# EAGLE design CAN-Adapter (EAGLE 6.2)
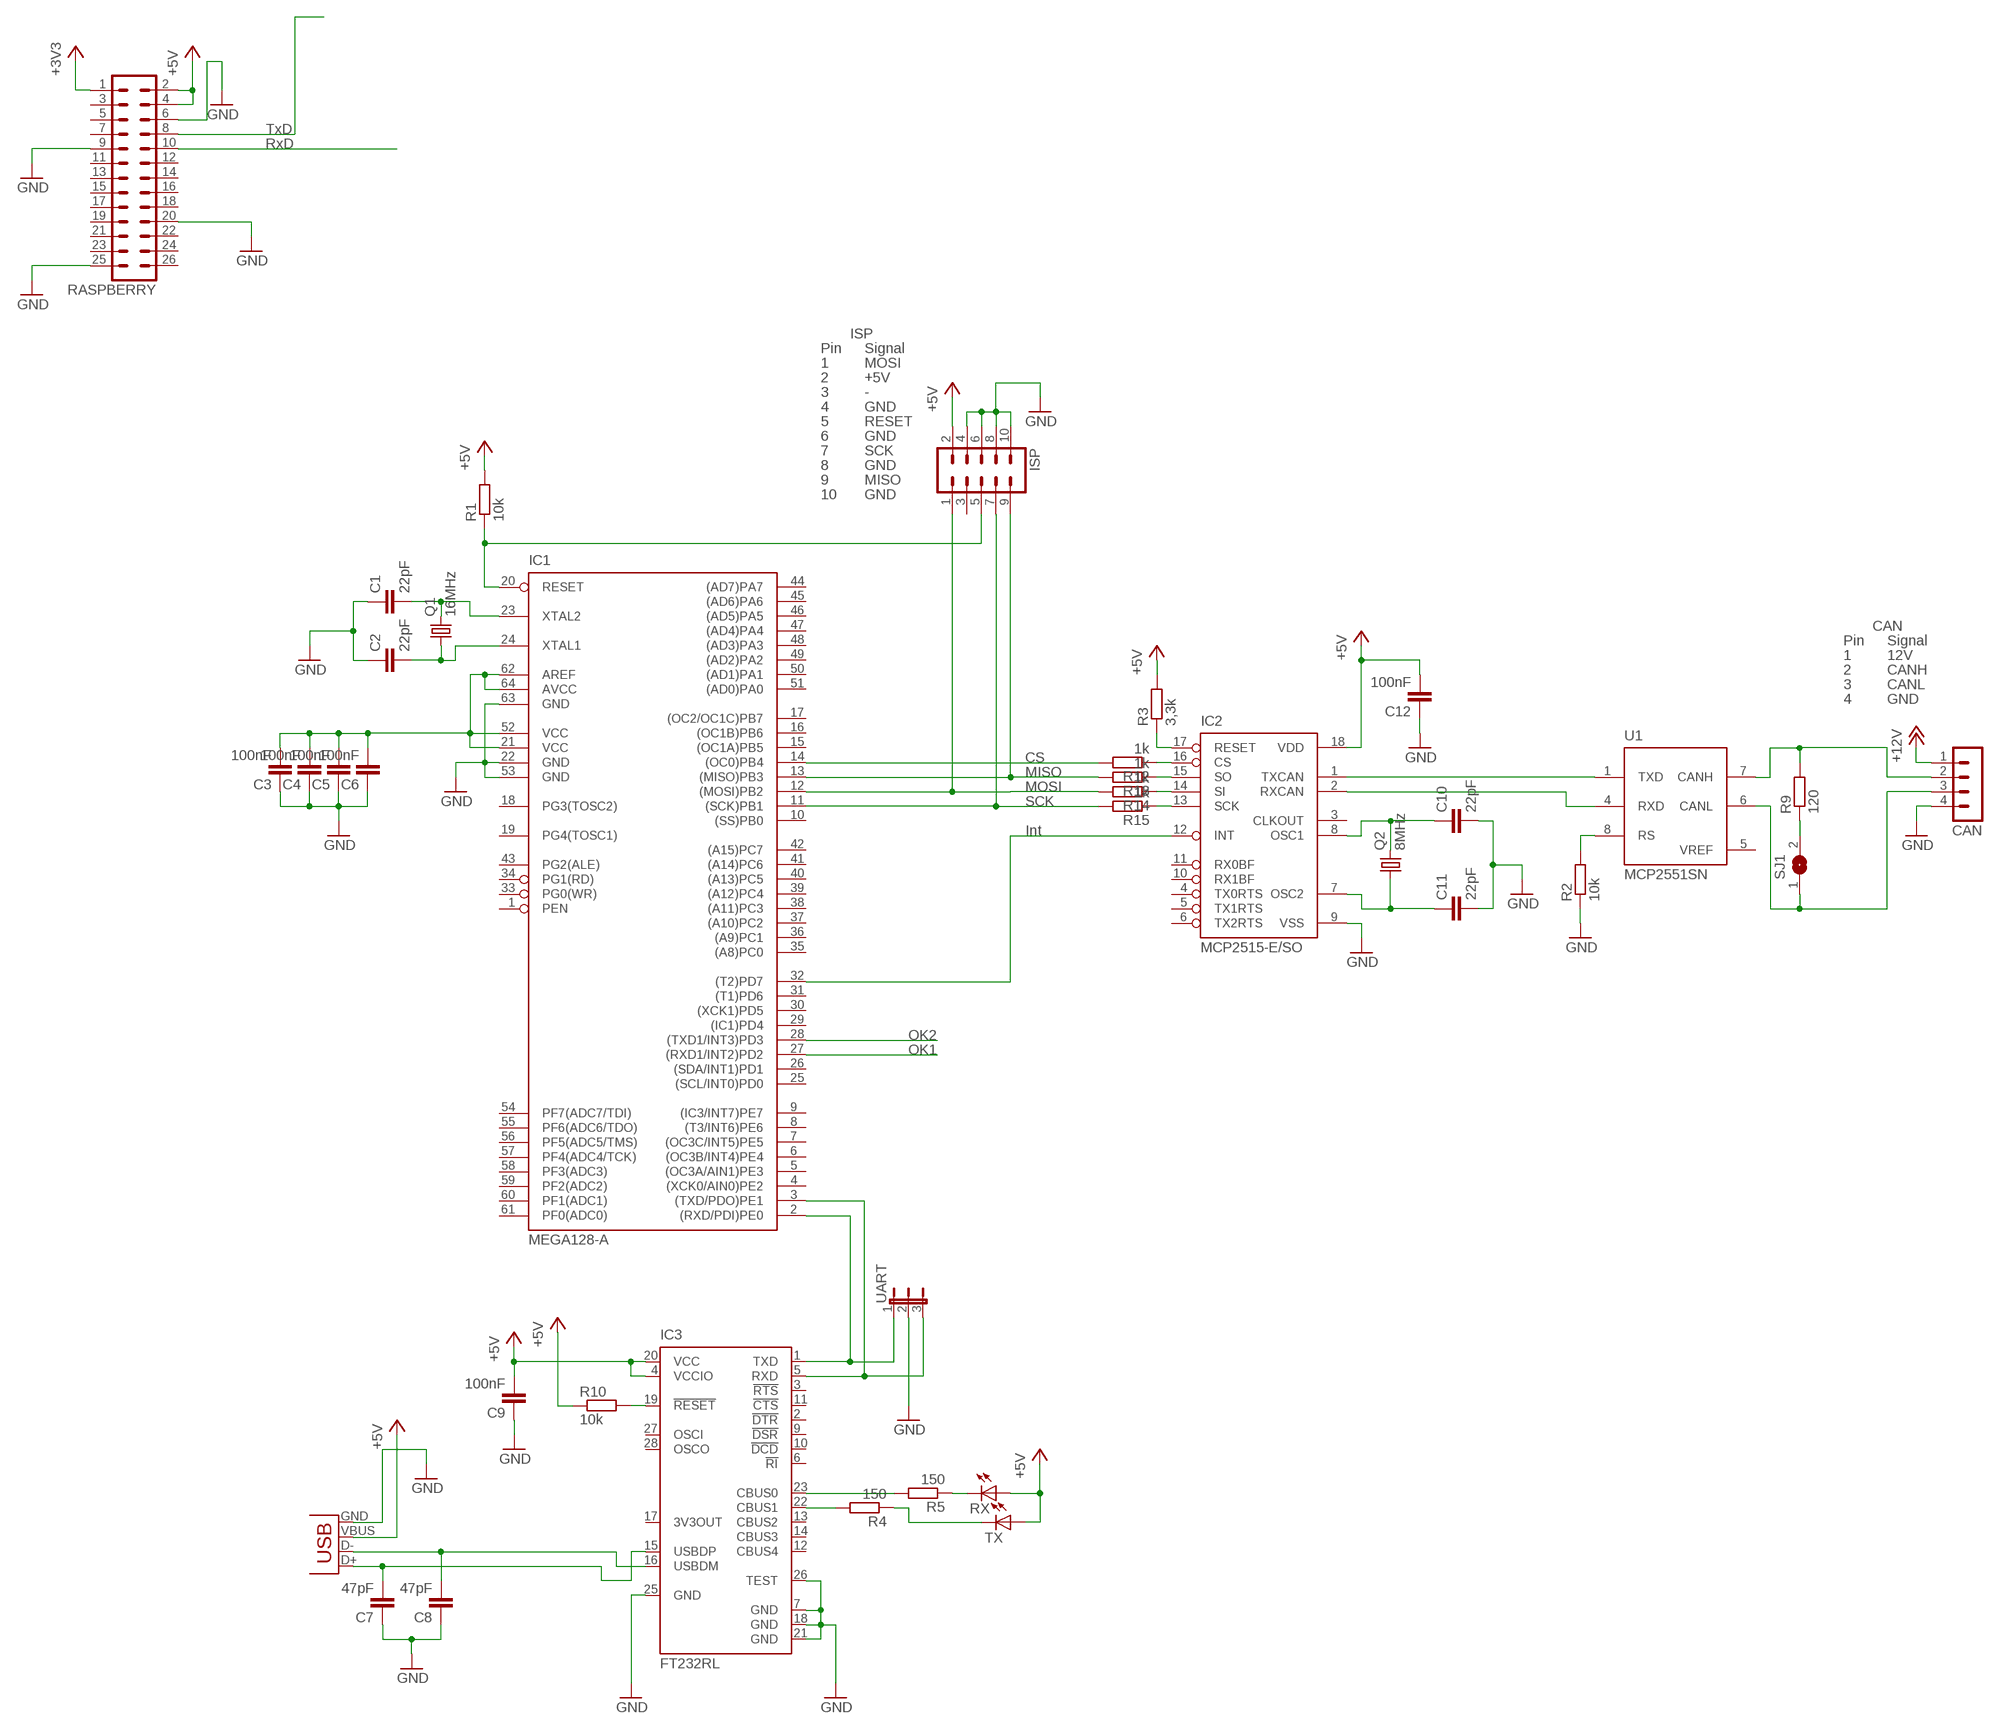
[diagram p0: schematic, sheet 1]

## Parts
C1  22pF  C-EUC0805  [C0805]
C2  22pF  C-EUC0805  [C0805]
C3  100nF  C-EUC0805  [C0805]
C4  100nF  C-EUC0805  [C0805]
C5  100nF  C-EUC0805  [C0805]
C6  100nF  C-EUC0805  [C0805]
C7  47pF  C-EUC0805  [C0805]
C8  47pF  C-EUC0805  [C0805]
C9  100nF  C-EUC0805  [C0805]
C10  22pF  C-EUC0805  [C0805]
C11  22pF  C-EUC0805  [C0805]
C12  100nF  C-EUC0805  [C0805]
CAN  MA04-1  [MA04-1]
IC1  MEGA128-A  [TQFP64]
IC2  MCP2515-E/SO  [SO18L]
IC3  FT232RL  [SSOP28]
ISP  ML10  [ML10]
Q1  16MHz  CSM-7X-DU  [CSM-7X-DU]
Q2  8MHz  CRYSTALHC49UP  [HC49UP]
R1  10k  R-EU_R0805  [R0805]
R2  10k  R-EU_M0805  [M0805]
R3  3,3k  R-EU_M0805  [M0805]
R4  150  R-EU_M0805  [M0805]
R5  150  R-EU_M0805  [M0805]
R9  120  R-EU_M0805  [M0805]
R10  10k  R-EU_M0805  [M0805]
R12  1k  R-EU_R0402  [R0402]
R13  1k  R-EU_R0402  [R0402]
R14  1k  R-EU_R0402  [R0402]
R15  1k  R-EU_R0402  [R0402]
RASPBERRY  MA13-2  [MA13-2]
RX  LEDCHIP-LED0805  [CHIP-LED0805]
SJ1  SJ  [SJ]
TX  LEDCHIP-LED0805  [CHIP-LED0805]
U1  MCP2551SN  [SO-08]
UART  JP2E  [JP2]
X1  USB-B-H  [USB-B-H]

## Nets
+3V3: RASPBERRY.1
+5V: C9.2 C12.2 IC2.18(VDD) IC3.4(VCCIO) IC3.20(VCC) ISP.2 R1.2 R3.2 R10.1 RASPBERRY.2 RASPBERRY.4 RX.A TX.A X1.VBUS
+12V: CAN.1
CANH: CAN.2 R9.2 U1.7(CANH)
CANL: CAN.3 SJ1.1 U1.6(CANL)
CHIPSELECT: IC1.14((OC0)PB4) R12.2
D+: C7.2 IC3.15(USBDP) X1.D+
D-: C8.2 IC3.16(USBDM) X1.D-
GND: C1.1 C2.1 C3.1 C4.1 C5.1 C6.1 C7.1 C8.1 C9.1 C10.2 C11.2 C12.1 CAN.4 IC1.22(GND) IC1.53(GND) IC1.63(GND) IC2.9(VSS) IC3.7(GND) IC3.18(GND) IC3.21(GND) IC3.25(GND) IC3.26(TEST) ISP.4 ISP.6 ISP.8 ISP.10 R2.1 RASPBERRY.6 RASPBERRY.9 RASPBERRY.20 RASPBERRY.25 UART.2 X1.GND
MISO1: IC1.13((MISO)PB3) ISP.9 R13.2
MOSI: IC1.12((MOSI)PB2) ISP.1 R14.2
N$1: C1.2 IC1.23(XTAL2) Q1.2
N$2: C2.2 IC1.24(XTAL1) Q1.1
N$3: R2.2 U1.8(RS)
N$4: IC1.20(RESET) ISP.5 R1.1
N$5: C3.2 C4.2 C5.2 C6.2 IC1.21(VCC) IC1.52(VCC) IC1.62(AREF) IC1.64(AVCC)
N$6: IC2.2(RXCAN) U1.4(RXD)
N$8: IC2.1(TXCAN) U1.1(TXD)
N$9: IC3.23(CBUS0) R5.2
N$10: C11.1 IC2.7(OSC2) Q2.1
N$11: C10.1 IC2.8(OSC1) Q2.2
N$13: IC2.17(RESET) R3.1
N$15: R4.1 TX.C
N$16: R5.1 RX.C
N$17: IC3.22(CBUS1) R4.2
N$26: IC1.32((T2)PD7) IC2.12(INT)
N$37: IC3.19(!RESET) R10.2
N$39: R9.1 SJ1.2
N$40: IC2.13(SCK) R15.1
N$41: IC2.14(SI) R14.1
N$42: IC2.15(SO) R13.1
N$43: IC2.16(CS) R12.1
RX: IC1.2((RXD/PDI)PE0) IC3.1(TXD) UART.1
RXD: RASPBERRY.10
RXD1: IC1.27((RXD1/INT2)PD2)
SCK1: IC1.11((SCK)PB1) ISP.7 R15.2
TX: IC1.3((TXD/PDO)PE1) IC3.5(RXD) UART.3
TXD: RASPBERRY.8
TXD1: IC1.28((TXD1/INT3)PD3)
Unconnected: IC1.1(PEN) IC1.4((XCK0/AIN0)PE2) IC1.5((OC3A/AIN1)PE3) IC1.6((OC3B/INT4)PE4) IC1.7((OC3C/INT5)PE5) IC1.8((T3/INT6)PE6) IC1.9((IC3/INT7)PE7) IC1.10((SS)PB0) IC1.15((OC1A)PB5) IC1.16((OC1B)PB6) IC1.17((OC2/OC1C)PB7) IC1.18(PG3(TOSC2)) IC1.19(PG4(TOSC1)) IC1.25((SCL/INT0)PD0) IC1.26((SDA/INT1)PD1) IC1.29((IC1)PD4) IC1.30((XCK1)PD5) IC1.31((T1)PD6) IC1.33(PG0(WR)) IC1.34(PG1(RD)) IC1.35((A8)PC0) IC1.36((A9)PC1) IC1.37((A10)PC2) IC1.38((A11)PC3) IC1.39((A12)PC4) IC1.40((A13)PC5) IC1.41((A14)PC6) IC1.42((A15)PC7) IC1.43(PG2(ALE)) IC1.44((AD7)PA7) IC1.45((AD6)PA6) IC1.46((AD5)PA5) IC1.47((AD4)PA4) IC1.48((AD3)PA3) IC1.49((AD2)PA2) IC1.50((AD1)PA1) IC1.51((AD0)PA0) IC1.54(PF7(ADC7/TDI)) IC1.55(PF6(ADC6/TDO)) IC1.56(PF5(ADC5/TMS)) IC1.57(PF4(ADC4/TCK)) IC1.58(PF3(ADC3)) IC1.59(PF2(ADC2)) IC1.60(PF1(ADC1)) IC1.61(PF0(ADC0)) IC2.3(CLKOUT) IC2.4(TX0RTS) IC2.5(TX1RTS) IC2.6(TX2RTS) IC2.10(RX1BF) IC2.11(RX0BF) IC3.2(!DTR) IC3.3(!RTS) IC3.6(!RI) IC3.9(!DSR) IC3.10(!DCD) IC3.11(!CTS) IC3.12(CBUS4) IC3.13(CBUS2) IC3.14(CBUS3) IC3.17(3V3OUT) IC3.27(OSCI) IC3.28(OSCO) ISP.3 RASPBERRY.3 RASPBERRY.5 RASPBERRY.7 RASPBERRY.11 RASPBERRY.12 RASPBERRY.13 RASPBERRY.14 RASPBERRY.15 RASPBERRY.16 RASPBERRY.17 RASPBERRY.18 RASPBERRY.19 RASPBERRY.21 RASPBERRY.22 RASPBERRY.23 RASPBERRY.24 RASPBERRY.26

## Notes on the sheet
- TxD
- RxD
- ISP
- Pin | Signal
- 1 | MOSI
- 2 | +5V
- 3 | -
- 4 | GND
- 5 | RESET
- 6 | GND
- 7 | SCK
- 8 | GND
- 9 | MISO
- 10 | GND
- CAN
- Pin | Signal
- 1 | 12V
- 2 | CANH
- 3 | CANL
- 4 | GND
- CS
- MISO
- MOSI
- SCK
- Int
- OK2
- OK1

## Power pins joined to a net without a drawn wire
VDD: U1.3(VDD)
VREF: U1.5(VREF)
VSS: U1.2(VSS)

## Library data of the parts
C1-C12 = rcl:C-EU: CAPACITOR, European symbol
CAN = con-lstb:MA04-1: PIN HEADER; OC_FARNELL: unknown; OC_NEWARK: unknown
IC1 = atmel:MEGA128: MICROCONTROLLER 128 Kbytes FLASH 4 Kbytes SRAM 4 Kbytes EEPROM DUAL USART 8-channel 10 bit ADC Source: avr.lbr; MPN: ATMEGA128-16AU; OC_FARNELL: 9171118; OC_NEWARK: 95K7364
IC2 = mcp2515:MCP2515
IC3 = ftdichip:FT232R: Source: http://www.ftdichip.com/Documents/DataSheets/DS_FT232R_v104.pdf; MPN: FT232RL; OC_FARNELL: 1146032; OC_NEWARK: 91K9918
ISP = con-harting-ml:ML10: HARTING; OC_FARNELL: unknown; OC_NEWARK: unknown
Q1 = crystal:CSM-7X-DU: SMD CRYSTAL Source: www.ecsxtal.com .. Crystal 3.6864MHz CSM_7X_DU.PDF; OC_FARNELL: unknown; OC_NEWARK: unknown
Q2 = crystal:CRYSTAL: CRYSTAL; OC_FARNELL: unknown; OC_NEWARK: unknown
R1-R5 R9 R10 R12-R15 = rcl:R-EU_: RESISTOR, European symbol
RASPBERRY = con-lstb:MA13-2: PIN HEADER; OC_FARNELL: unknown; OC_NEWARK: unknown
RX TX = led:LED: LED OSRAM: - CHIPLED LG R971, LG N971, LY N971, LG Q971, LY Q971, LO R971, LY R971 LH N974, LH R974 LS Q976, LO Q976, LY Q976 LO Q996 - Hyper CHIPLED LW Q18S LB Q993, LB Q99A, LB R99A - SideLED LS A670, LO A670, LY A670, LG A670, LP A670 LB A673, LV A673, LT A673, LW A673 LH A674 LY A675 LS A676, LA A676, LO A676, LY A676, LW A676 LS A679, LY A679, LG A679 - Hyper Micro SIDELED® LS Y876, LA Y876, LO Y876, LY Y876 LT Y87S - SmartLED LW L88C, LW L88S LB L89C, LB L89S, LG L890 LS L89K, LO L89K, LY L89K LS L896, LA L896, LO L896, LY L896 - TOPLED LS T670, LO T670, LY T670, LG T670, LP T670 LSG T670, LSP T670, LSY T670, LOP T670, LYG T670 LG T671, LOG T671, LSG T671 LB T673, LV T673, LT T673, LW T673 LH T674 LS T676, LA T676, LO T676, LY T676, LB T676, LH T676, LSB T676, LW T676 LB T67C, LV T67C, LT T67C, LS T67K, LO T67K, LY T67K, LW E67C LS E67B, LA E67B, LO E67B, LY E67B, LB E67C, LV E67C, LT E67C LW T67C LS T679, LY T679, LG T679 LS T770, LO T770, LY T770, LG T770, LP T770 LB T773, LV T773, LT T773, LW T773 LH T774 LS E675, LA E675, LY E675, LS T675 LS T776, LA T776, LO T776, LY T776, LB T776 LHGB T686 LT T68C, LB T68C - Hyper Mini TOPLED® LB M676 - Mini TOPLED Santana® LG M470 LS M47K, LO M47K, LY M47K Source: http://www.osram.convergy.de LUXEON: - LUMILED® LXK2-PW12-R00, LXK2-PW12-S00, LXK2-PW14-U00, LXK2-PW14-V00 LXK2-PM12-R00, LXK2-PM12-S00, LXK2-PM14-U00 LXK2-PE12-Q00, LXK2-PE12-R00, LXK2-PE12-S00, LXK2-PE14-T00, LXK2-PE14-U00 LXK2-PB12-K00, LXK2-PB12-L00, LXK2-PB12-M00, LXK2-PB14-N00, LXK2-PB14-P00, LXK2-PB14-Q00 LXK2-PR12-L00, LXK2-PR12-M00, LXK2-PR14-Q00, LXK2-PR14-R00 LXK2-PD12-Q00, LXK2-PD12-R00, LXK2-PD12-S00 LXK2-PH12-R00, LXK2-PH12-S00 LXK2-PL12-P00, LXK2-PL12-Q00, LXK2-PL12-R00 Source: www.luxeon.com KINGBRIGHT: KA-3528ASYC Source: www.kingbright.com
SJ1 = jumper:SJ: SMD solder JUMPER
U1 = microchip_can:MCP2551: High Speed CAN tranceiver
UART = jumper:JP2E: JUMPER
X1 = con-usb:USB: USB Connectors

## Board
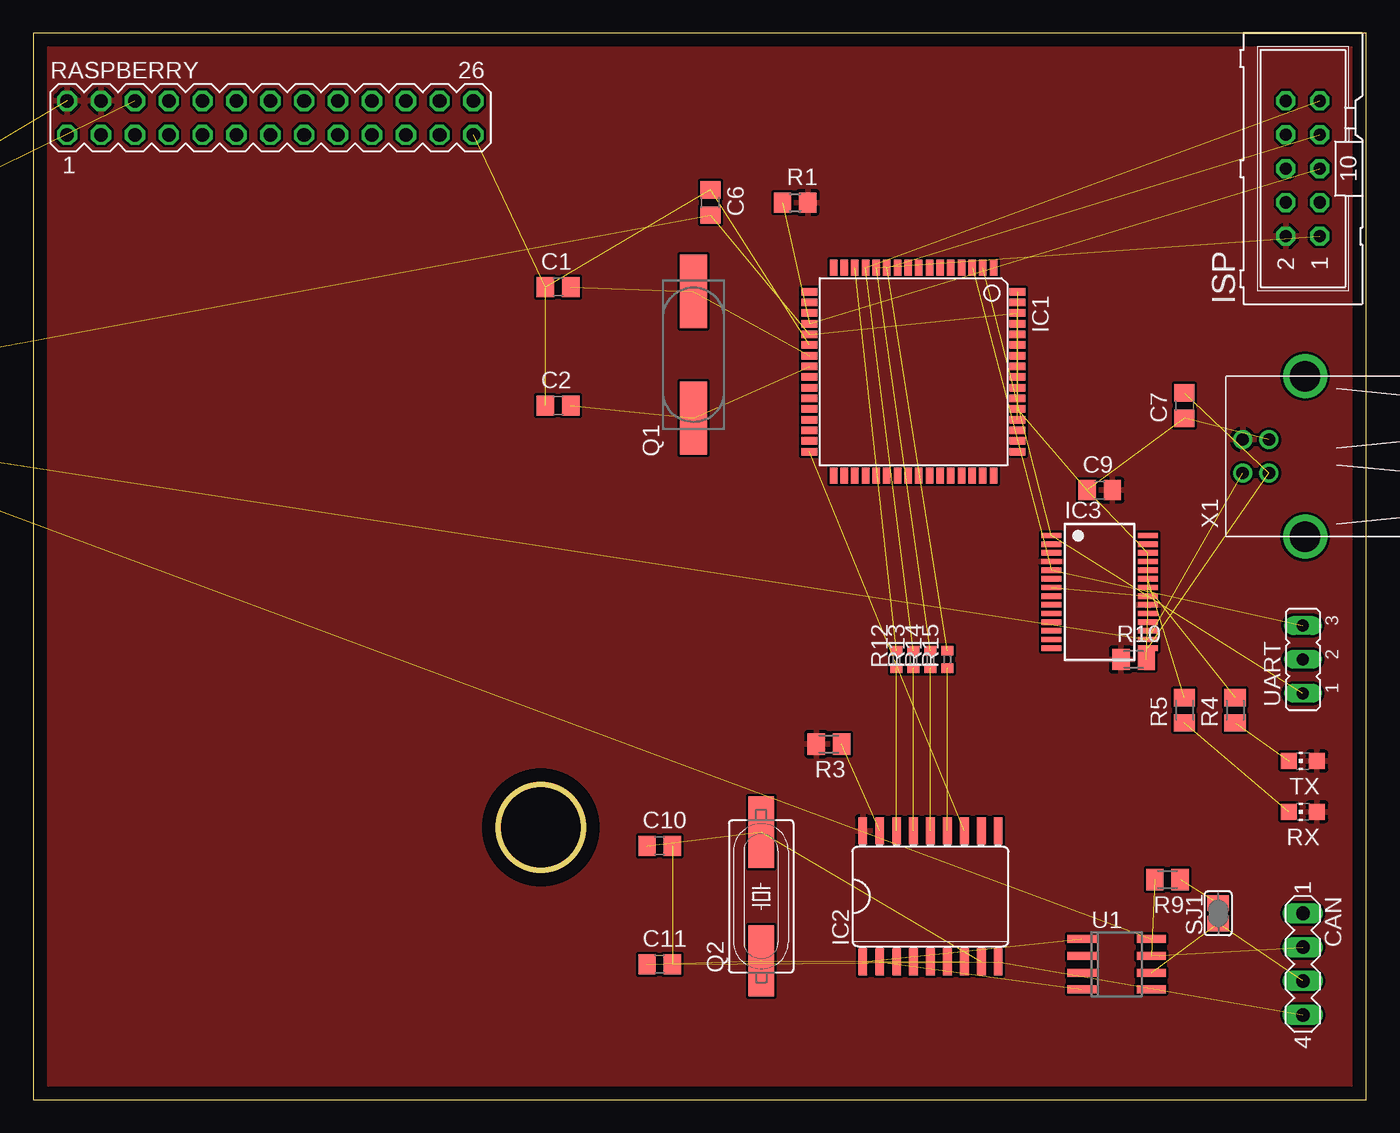
[diagram p1: board, top side]
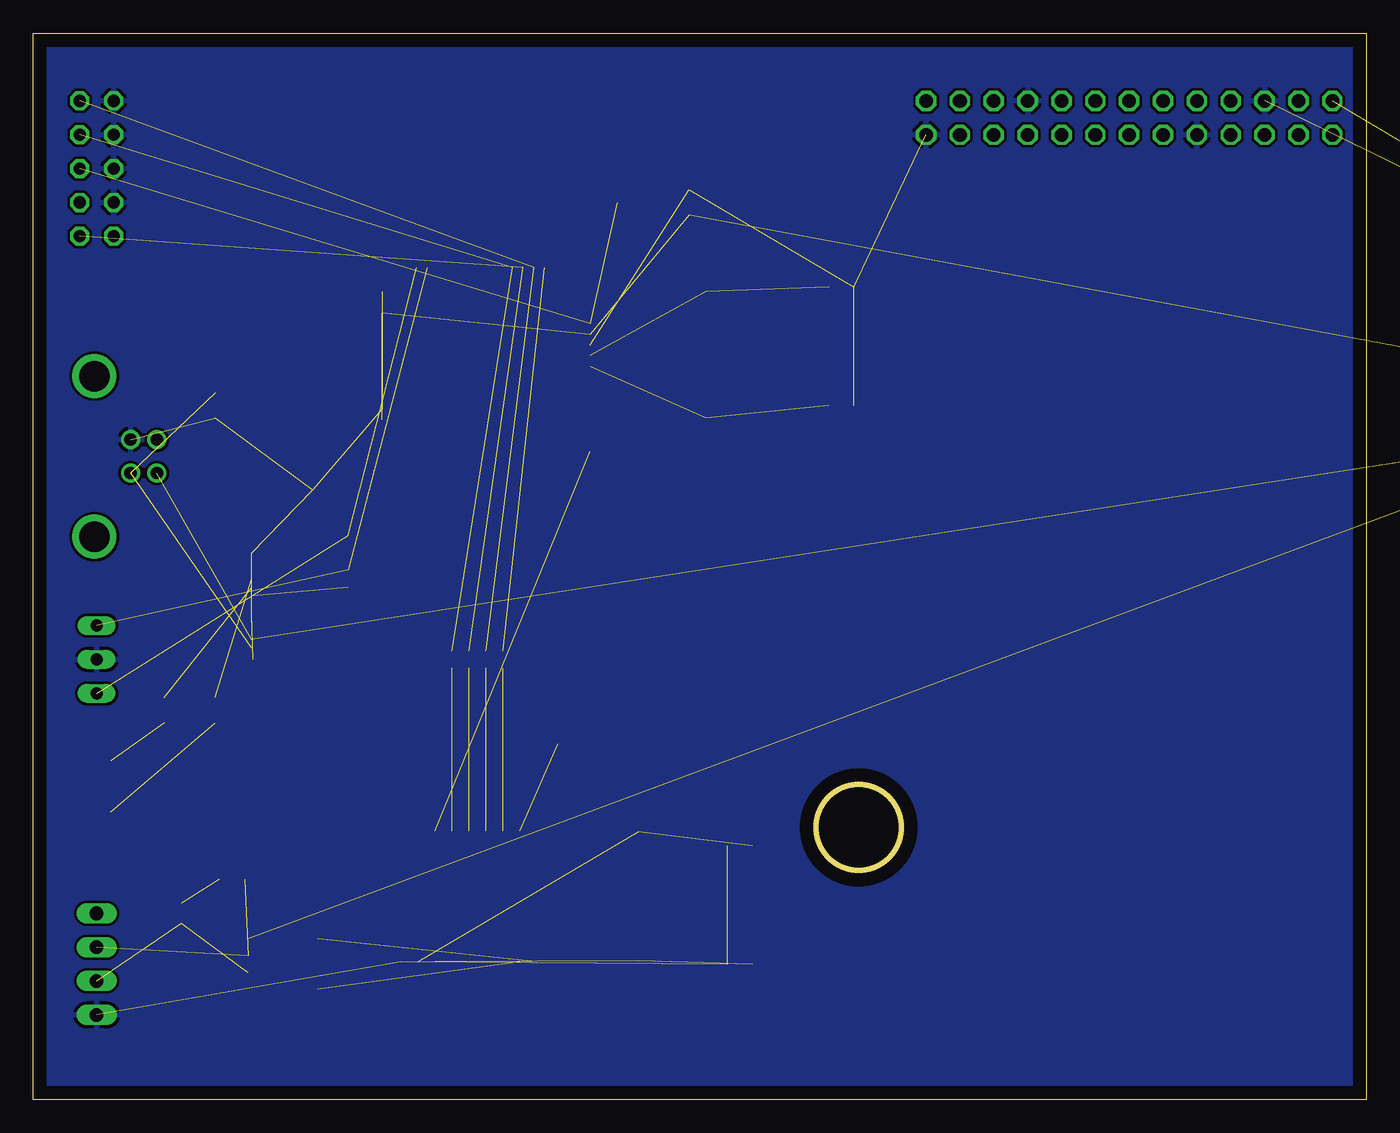
[diagram p2: board, bottom side, seen from below]

Size 100 x 80 mm. Coordinates in mm from the lower left corner, seen from the top.
Outline: 0,0 100,0 100,80 0,80 0,0
Outline: circle at 38.08,20.43 radius 3.2
Copper layers (1*16): Top 0.035mm / dielectric 1.5mm / Bottom 0.035mm
Design rules: minimum track width 10mil, minimum drill 24mil, track to track 8mil, track to pad 8mil, pad to pad 8mil, via to via 8mil, smd to smd 8mil, copper to edge 40mil, drill to drill 8mil, minimum pad ring 10mil, minimum via ring 8mil, stop-mask expansion 4mil, vias tented up to drill 0mil, thermal gap 10mil

### Footprints (pad centres in the part's own frame; a part is rotated, then mirrored left to right if it is on the bottom)
C0805 = smd 1.3 x 1.5: 1 -0.95,0; 2 0.95,0
MA04-1 = drill 1.016 long: 1 -3.81,0; 2 -1.27,0; 3 1.27,0; 4 3.81,0
TQFP64 = smd 1.194 x 0.559: 1 -7.8,6; 2 -7.8,5.2; 3 -7.8,4.4; 4 -7.8,3.6; 5 -7.8,2.8; 6 -7.8,2; 7 -7.8,1.2; 8 -7.8,0.4; 9 -7.8,-0.4; 10 -7.8,-1.2; 11 -7.8,-2; 12 -7.8,-2.8; 13 -7.8,-3.6; 14 -7.8,-4.4; 15 -7.8,-5.2; 16 -7.8,-6; 33 7.8,-6; 34 7.8,-5.2; 35 7.8,-4.4; 36 7.8,-3.6; 37 7.8,-2.8; 38 7.8,-2; 39 7.8,-1.2; 40 7.8,-0.4; 41 7.8,0.4; 42 7.8,1.2; 43 7.8,2; 44 7.8,2.8; 45 7.8,3.6; 46 7.8,4.4; 47 7.8,5.2; 48 7.8,6 | smd 0.559 x 1.194: 17 -6,-7.8; 18 -5.2,-7.8; 19 -4.4,-7.8; 20 -3.6,-7.8; 21 -2.8,-7.8; 22 -2,-7.8; 23 -1.2,-7.8; 24 -0.4,-7.8; 25 0.4,-7.8; 26 1.2,-7.8; 27 2,-7.8; 28 2.8,-7.8; 29 3.6,-7.8; 30 4.4,-7.8; 31 5.2,-7.8; 32 6,-7.8; 49 6,7.8; 50 5.2,7.8; 51 4.4,7.8; 52 3.6,7.8; 53 2.8,7.8; 54 2,7.8; 55 1.2,7.8; 56 0.4,7.8; 57 -0.4,7.8; 58 -1.2,7.8; 59 -2,7.8; 60 -2.8,7.8; 61 -3.6,7.8; 62 -4.4,7.8; 63 -5.2,7.8; 64 -6,7.8
SO18L = smd 0.66 x 2.032: 1 -5.08,-4.902; 2 -3.81,-4.902; 3 -2.54,-4.902; 4 -1.27,-4.902; 5 0,-4.902; 6 1.27,-4.902; 7 2.54,-4.902; 8 3.81,-4.902; 9 5.08,-4.902; 10 5.08,4.902; 11 3.81,4.902; 12 2.54,4.902; 13 1.27,4.902; 14 0,4.902; 15 -1.27,4.902; 16 -2.54,4.902; 17 -3.81,4.902; 18 -5.08,4.902
SSOP28 = smd 0.4 x 1.5: 1 -4.225,-3.625; 2 -3.575,-3.625; 3 -2.925,-3.625; 4 -2.275,-3.625; 5 -1.625,-3.625; 6 -0.975,-3.625; 7 -0.325,-3.625; 8 0.325,-3.625; 9 0.975,-3.625; 10 1.625,-3.625; 11 2.275,-3.625; 12 2.925,-3.625; 13 3.575,-3.625; 14 4.225,-3.625; 15 4.225,3.625; 16 3.575,3.625; 17 2.925,3.625; 18 2.275,3.625; 19 1.625,3.625; 20 0.975,3.625; 21 0.325,3.625; 22 -0.325,3.625; 23 -0.975,3.625; 24 -1.625,3.625; 25 -2.275,3.625; 26 -2.925,3.625; 27 -3.575,3.625; 28 -4.225,3.625
ML10 = drill 0.914 octagon: 1 -5.08,-1.27; 2 -5.08,1.27; 3 -2.54,-1.27; 4 -2.54,1.27; 5 0,-1.27; 6 0,1.27; 7 2.54,-1.27; 8 2.54,1.27; 9 5.08,-1.27; 10 5.08,1.27
CSM-7X-DU = smd 5.5 x 2: 1 -4.75,0; 2 4.75,0
HC49UP = smd 5.334 x 1.93: 1 -4.826,0; 2 4.826,0
R0805 = smd 1.3 x 1.5: 1 -0.95,0; 2 0.95,0
M0805 = smd 1.3 x 1.6: 1 -0.95,0; 2 0.95,0
R0402 = smd 0.7 x 0.9: 1 -0.65,0; 2 0.65,0
MA13-2 = drill 1.016 octagon: 1 -15.24,-1.27; 2 -15.24,1.27; 3 -12.7,-1.27; 4 -12.7,1.27; 5 -10.16,-1.27; 6 -10.16,1.27; 7 -7.62,-1.27; 8 -7.62,1.27; 9 -5.08,-1.27; 10 -5.08,1.27; 11 -2.54,-1.27; 12 -2.54,1.27; 13 0,-1.27; 14 0,1.27; 15 2.54,-1.27; 16 2.54,1.27; 17 5.08,-1.27; 18 5.08,1.27; 19 7.62,-1.27; 20 7.62,1.27; 21 10.16,-1.27; 22 10.16,1.27; 23 12.7,-1.27; 24 12.7,1.27; 25 15.24,-1.27; 26 15.24,1.27
CHIP-LED0805 = smd 1.2 x 1.2: A 0,-1.05; C 0,1.05
SJ = smd 1.168 x 1.6: 1 -0.762,0; 2 0.762,0
SO-08 = smd 0.6 x 2.2: 1 -1.905,-2.6; 2 -0.635,-2.6; 3 0.635,-2.6; 4 1.905,-2.6; 5 1.905,2.6; 6 0.635,2.6; 7 -0.635,2.6; 8 -1.905,2.6
JP2 = drill 0.914 long: 1 -2.54,0; 2 0,0; 3 2.54,0
USB-B-H = drill 0.914: D+ 0,1.25; D- 1.981,1.25; GND 0,-1.25; VBUS 1.981,-1.25 | drill 2.286: P$1 -2.718,-6.02; P$2 -2.718,6.02

### Placement (x,y rotation side)
C1  39.37,60.96 0 top
C2  39.37,52.07 0 top
C3  -54.61,46.99 0 top  (outside the outline)
C4  -60.96,46.99 0 top  (outside the outline)
C5  -67.31,46.99 0 top  (outside the outline)
C6  50.8,67.31 270 top
C7  86.36,52.07 90 top
C8  -55.88,55.88 0 top  (outside the outline)
C9  80.01,45.72 0 top
C10  46.99,19.05 0 top
C11  46.99,10.16 0 top
C12  -30.48,55.88 0 top  (outside the outline)
CAN  95.25,10.16 270 top
IC1  66.04,54.61 270 top
IC2  67.31,15.24 0 top
IC3  80.01,38.1 270 top
ISP  95.25,69.85 90 top
Q1  49.53,55.88 90 top
Q2  54.61,15.24 90 top
R1  57.15,67.31 0 top
R2  -52.07,62.23 0 top  (outside the outline)
R3  59.69,26.67 180 top
R4  90.17,29.21 90 top
R5  86.36,29.21 90 top
R9  85.09,16.51 180 top
R10  82.55,33.02 0 top
R12  64.77,33.02 90 top
R13  66.04,33.02 90 top
R14  67.31,33.02 90 top
R15  68.58,33.02 90 top
RASPBERRY  17.78,73.66 0 top
RX  95.25,21.59 90 top
SJ1  88.9,13.97 90 top
TX  95.25,25.4 90 top
U1  81.28,10.16 270 top
UART  95.25,33.02 90 top
X1  92.71,48.26 180 top

### Tracks (layer width: path | path; a pad name or v marks a point on that pad's centre or on a via)
+5V  (1 unrouted)
  pour Top: 0,88.9 111.76,88.9 111.76,-6.35 -5.08,-6.35 -5.08,88.9
CANH  (2 unrouted)
CANL  (2 unrouted)
CHIPSELECT  (1 unrouted)
D+  (2 unrouted)
D-  (2 unrouted)
GND  (22 unrouted)
  pour Bottom: -3.81,91.44 107.95,91.44 107.95,-6.35 -3.81,-6.35
MISO1  (2 unrouted)
MOSI  (2 unrouted)
N$1  (2 unrouted)
N$2  (2 unrouted)
N$3  (1 unrouted)
N$4  (2 unrouted)
N$5  (7 unrouted)
N$6  (1 unrouted)
N$8  (1 unrouted)
N$9  (1 unrouted)
N$10  (2 unrouted)
N$11  (2 unrouted)
N$13  (1 unrouted)
N$15  (1 unrouted)
N$16  (1 unrouted)
N$17  (1 unrouted)
N$26  (1 unrouted)
N$37  (1 unrouted)
N$39  (1 unrouted)
N$40  (1 unrouted)
N$41  (1 unrouted)
N$42  (1 unrouted)
N$43  (1 unrouted)
RX  (2 unrouted)
SCK1  (2 unrouted)
TX  (2 unrouted)